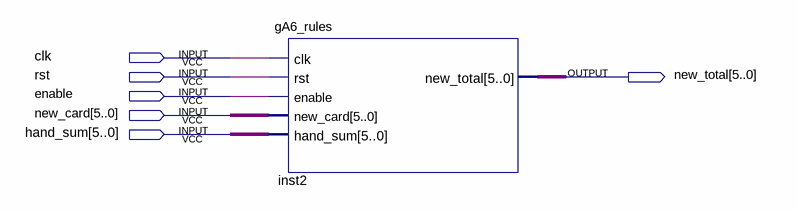
[diagram p0: schematic sheet]
// Quartus schematic Block4.bdf as structural Verilog: 1 symbols, 6 pins
module Block4 (
  input  clk,
  input  rst,
  input  enable,
  input  [5:0] new_card,
  input  [5:0] hand_sum,
  output [5:0] new_total
);

  gA6_rules inst2 (
    .clk(clk), .enable(enable), .hand_sum(hand_sum), .new_card(new_card), .rst(rst), .new_total(new_total));
endmodule
